# EAGLE design rfm69gw (EAGLE 7.3.0)
PROJECT_AUTHOR: tinkerman.cat <xose.perez@gmail.com>; PROJECT_LICENSE: GPLv3; PROJECT_NAME: RFM69GW; PROJECT_VERSION: 0.3.20160731
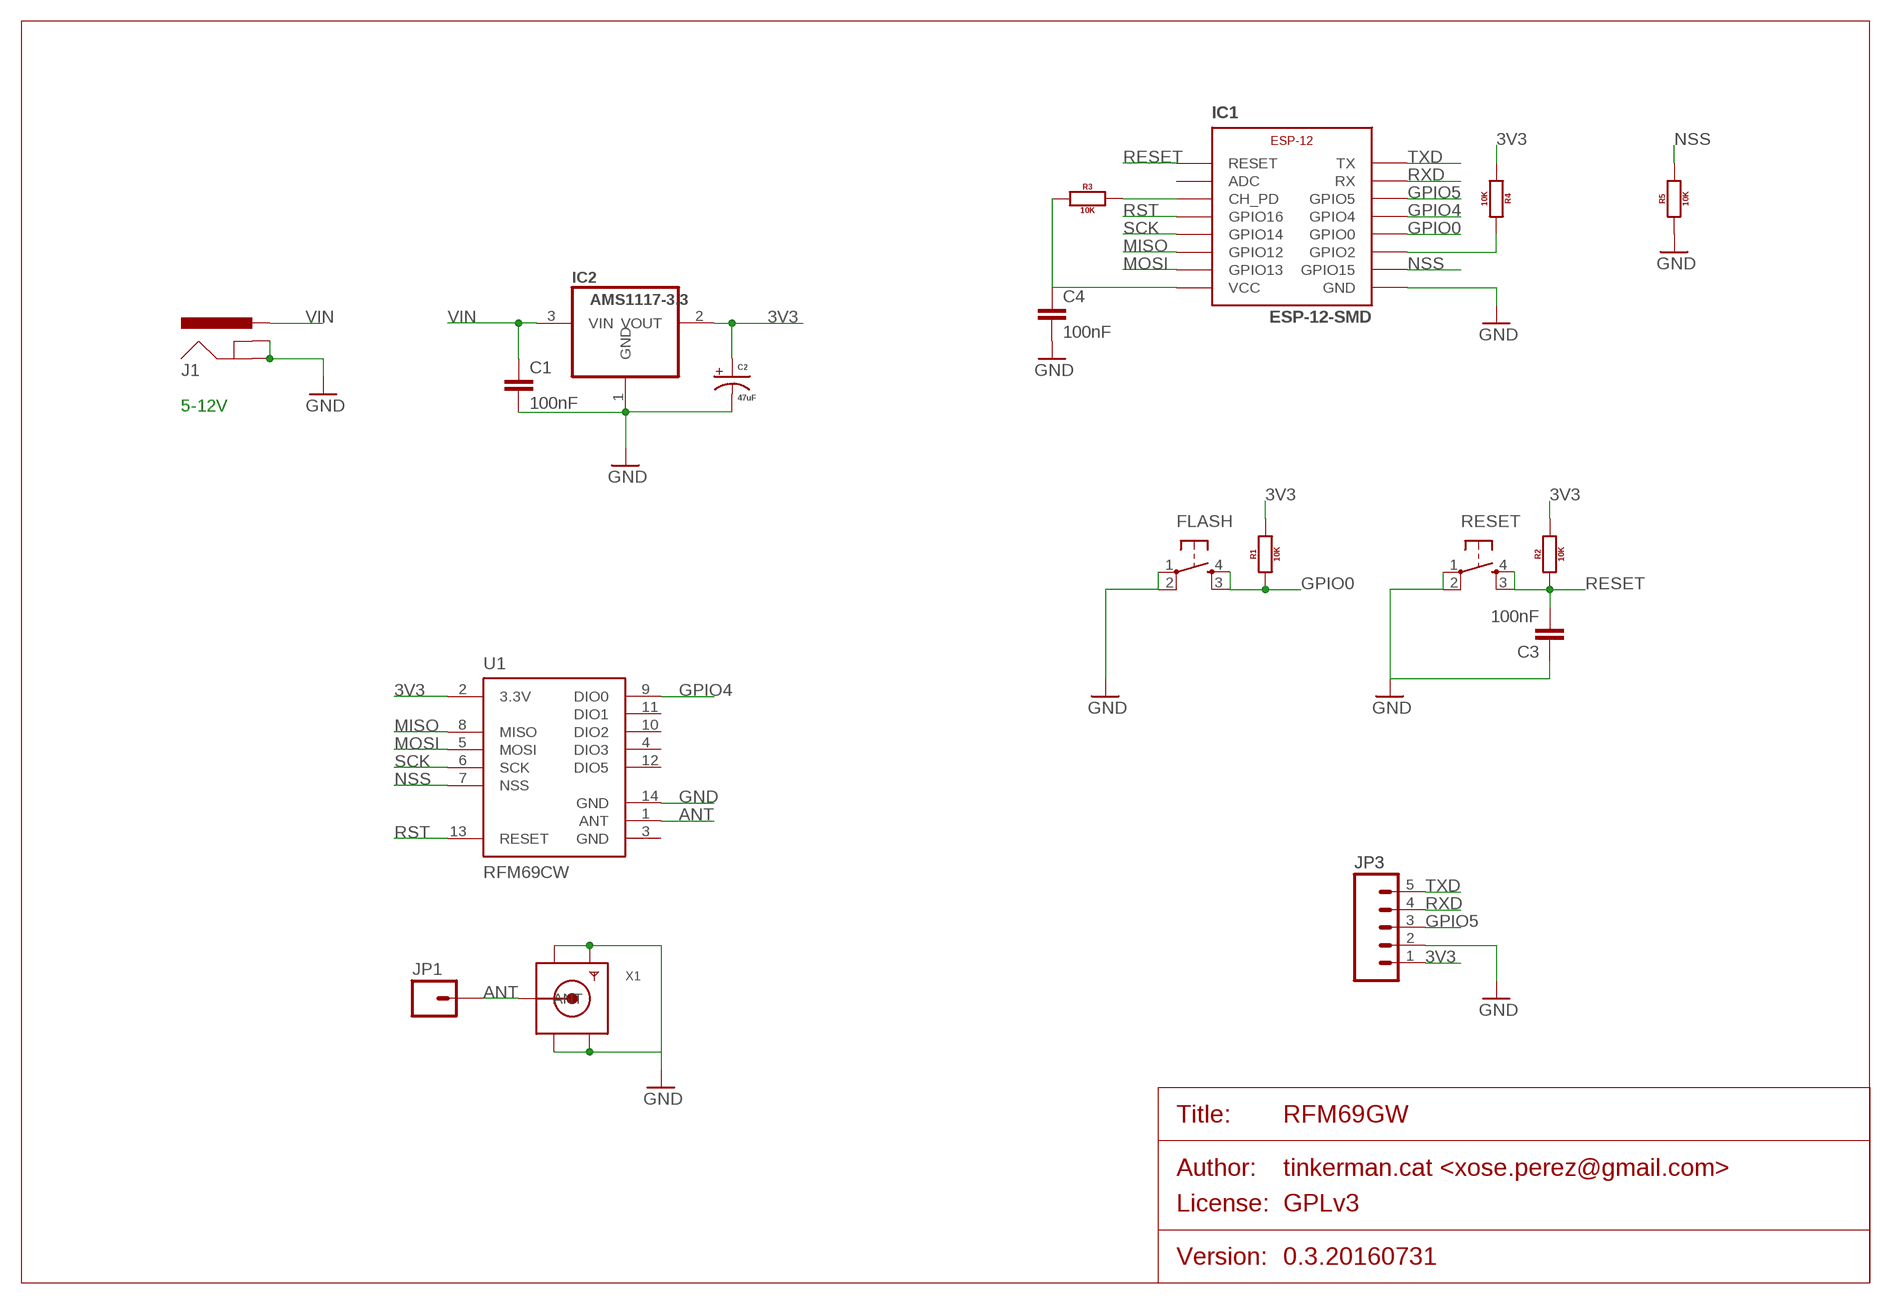
[diagram p0: schematic, sheet 1]

## Parts
C1  100nF  C-EU050-025X075  [C050-025X075]
C2  47uF  CAP_POLPTH2  [CPOL-RADIAL-10UF-25V]
C3  100nF  C-EU050-025X075  [C050-025X075]
C4  100nF  C-EU050-025X075  [C050-025X075]
FLASH  TACTILE_BUTTON_SMD  [TACTILE-BUTTON-SMD]
IC1  ESP-12-SMD  [ESP-12-SMD]
IC2  AMS1117-3.3  REG1117  [SOT223]
J1  POWER_JACKPTH  [POWER_JACK_PTH]
JP1  M01SMDNS  [1X01NS]
JP3  M05PTH  [1X05]
R1  10K  RESISTORPTH-400MIL  [AXIAL-0.4]
R2  10K  RESISTORPTH-400MIL  [AXIAL-0.4]
R3  10K  RESISTORPTH-400MIL  [AXIAL-0.4]
R4  10K  RESISTORPTH-400MIL  [AXIAL-0.4]
R5  10K  RESISTORPTH-400MIL  [AXIAL-0.4]
RESET  TACTILE_BUTTON_SMD  [TACTILE-BUTTON-SMD]
U1  RFM69CW  [RFM69CW-XXXS2]
X1  SMACONNECTOR_EDGE  [SMA_EDGELAUNCH]

## Nets
3V3: C2.1(+) C4.1 IC1.VCC IC2.2(VOUT) JP3.1 R1.P$2 R2.P$2 R3.P$1 R4.P$1 U1.2(3.3V)
ANT: JP1.1 U1.1(ANT) X1.P(ANT)
GND: C1.2 C2.2(-) C3.1 C4.2 FLASH.1(SWA1) FLASH.2(SWB1) IC1.GND IC2.1(GND) J1.GND J1.GNDBREAK JP3.2 R5.P$1 RESET.1(SWA1) RESET.2(SWB1) U1.14(GND) X1.GND@1(GND4) X1.GND@2(GND3) X1.GND@3(GND2) X1.GND@4(GND1)
GPIO0: FLASH.3(SWB2) FLASH.4(SWA2) IC1.GPIO0 R1.P$1
GPIO4: IC1.GPIO4 U1.9(DIO0)
GPIO5: IC1.GPIO5 JP3.3
MISO: IC1.GPIO12 U1.8(MISO)
MOSI: IC1.GPIO13 U1.5(MOSI)
N$1: IC1.CH_PD R3.P$2
N$4: IC1.GPIO2 R4.P$2
NSS: IC1.GPIO15 R5.P$2 U1.7(NSS)
RESET: C3.2 IC1.RESET R2.P$1 RESET.3(SWB2) RESET.4(SWA2)
RST: IC1.GPIO16 U1.13(RESET)
RXD: IC1.RX JP3.4
SCK: IC1.GPIO14 U1.6(SCK)
TXD: IC1.TX JP3.5
VIN: C1.1 IC2.3(VIN) J1.PWR
Unconnected: IC1.ADC U1.4(DIO3) U1.10(DIO2) U1.11(DIO1) U1.12(DIO5)

## Notes on the sheet
- 5-12V

## Power pins joined to a net without a drawn wire
GND: U1.3(GND)

## Library data of the parts
C1 C3 C4 = xose:C-EU: CAPACITOR, European symbol
C2 = xose:CAP_POL: Capacitor Polarized These are standard SMD and PTH capacitors. Normally 10uF, 47uF, and 100uF in electrolytic and tantalum varieties. Always verify the external diameter of the through hole cap, it varies with capacity, voltage, and manufacturer. The EIA devices should be standard.
FLASH RESET = xose:TACTILE_BUTTON: Tactile Button SparkFun Electronics' Tactile Button COM-10302
IC1 = xose:ESP-12
IC2 = xose:REG1117: 800mA and 1A Low Dropout (LDO) Positive Regulator 1.8V, 2.5V, 2.85V, 3.3V, 5V, and Adj; MPN: REG1117; OC_FARNELL: 1097566; OC_NEWARK: 14P6981
J1 = xose:POWER_JACK: Power Jack This is the standard 5.5mm barrel jack for power. The PTH is the most common, proven, reliable, footprint. The Slot footprint only works if the mill layer is transmitted to the PCB fab house so be warned. Mating wall wart : TOL-00298 (and others); PROD_ID: CONN-08197
JP1 = SparkFun-Connectors:M01: Header 1 Standard 1-pin 0.1" header. Use with straight break away headers (SKU : PRT-00116), right angle break away headers (PRT-00553), swiss pins (PRT-00743), machine pins (PRT-00117), and female headers (PRT-00115).
JP3 = xose:M05: Header 5 Standard 5-pin 0.1" header. Use with straight break away headers (SKU : PRT-00116), right angle break away headers (PRT-00553), swiss pins (PRT-00743), machine pins (PRT-00117), and female headers (PRT-00115). Molex polarized connector foot print use with SKU : PRT-08230 with associated crimp pins and housings.
R1-R5 = xose:RESISTOR: Generic EU resistor symbol
U1 = xose:RFM69
X1 = adafruit:SMACONNECTOR: SMA Connector 90° DIP SMA Connector, 50 Ohm (4UConnector: 07259)

## Board
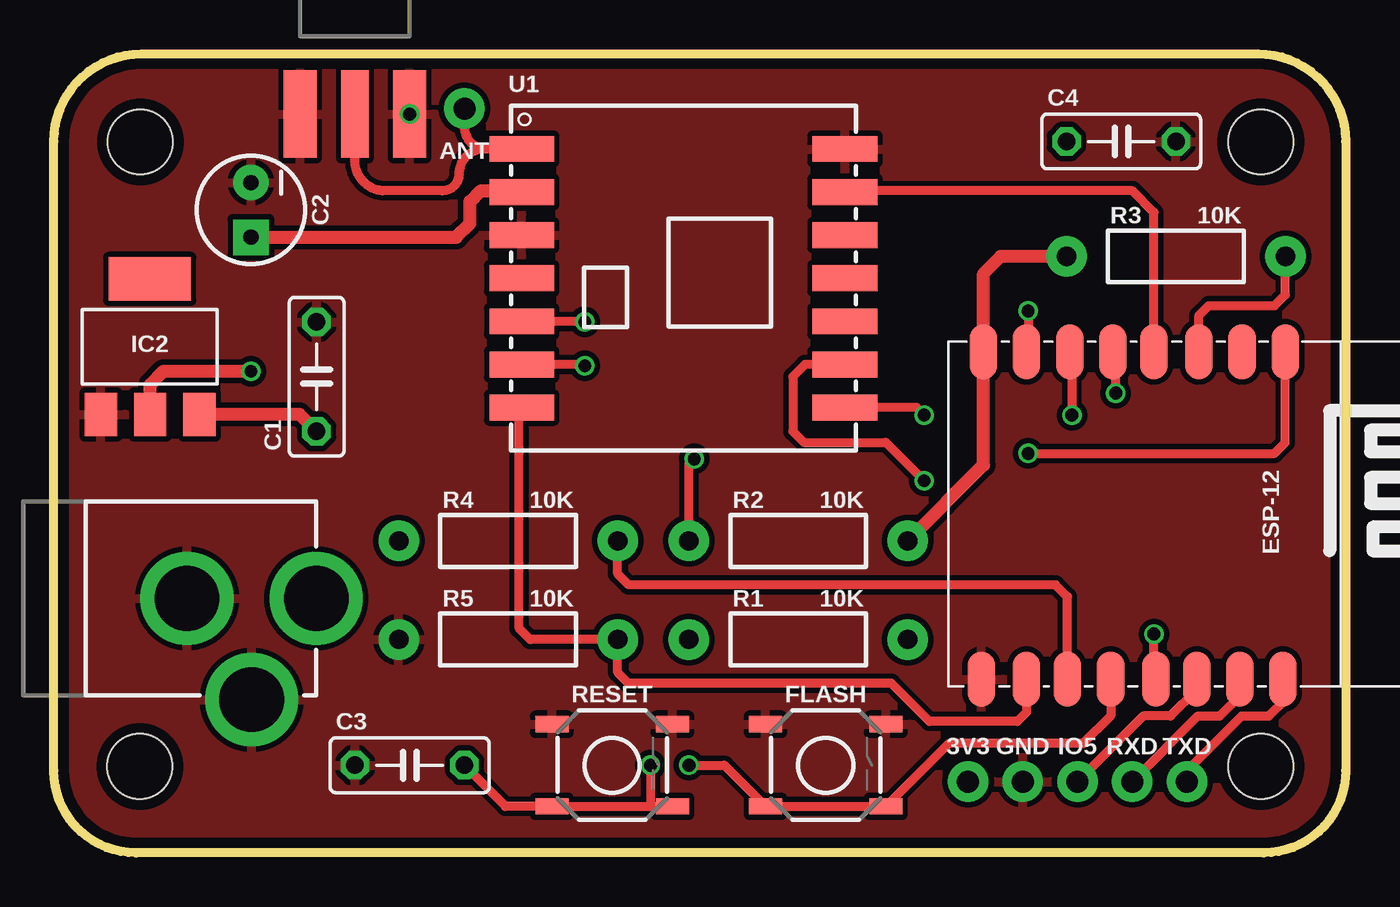
[diagram p1: board, top side]
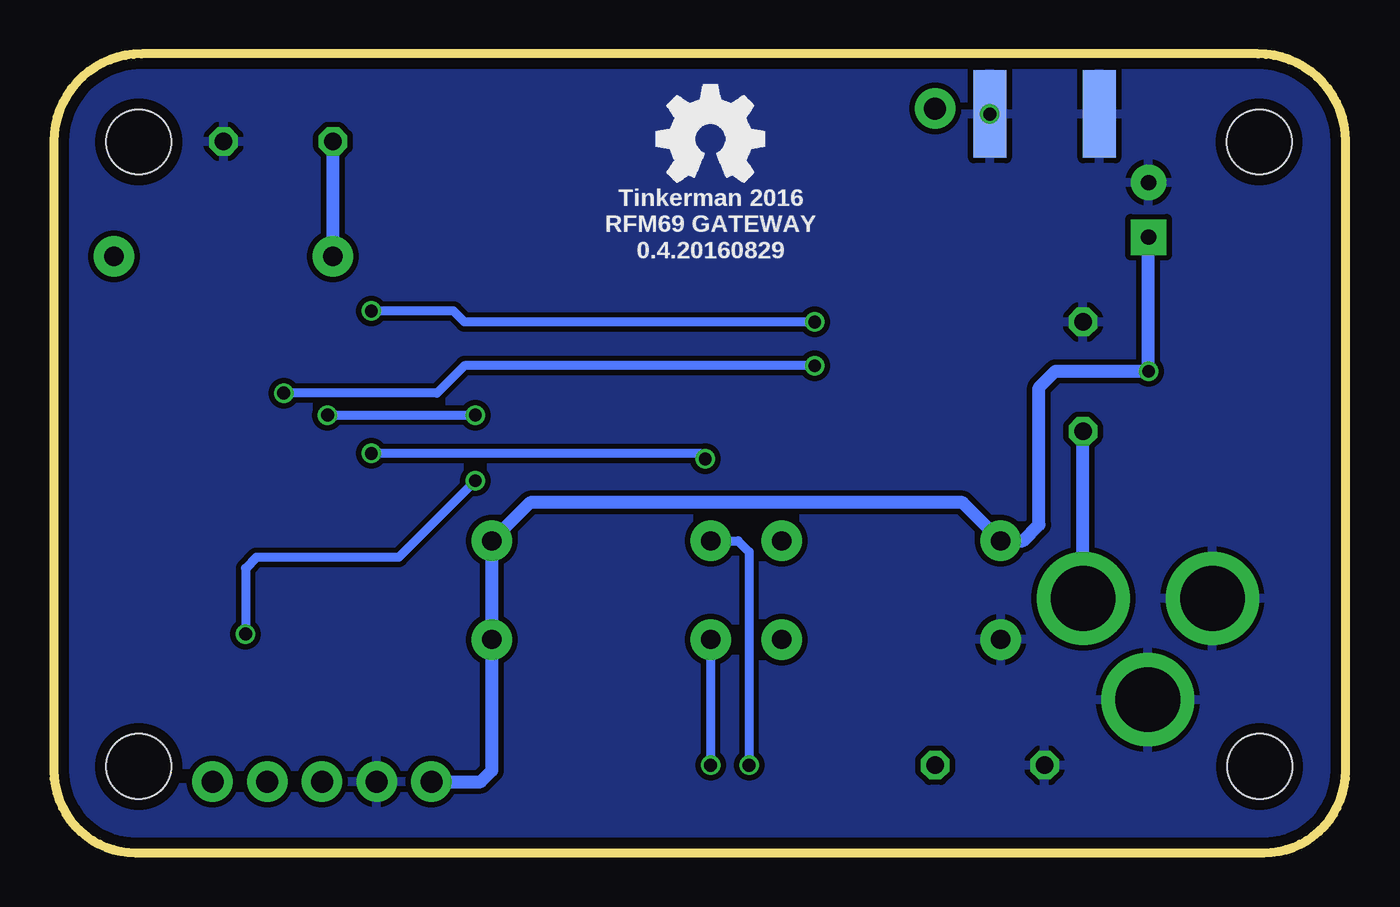
[diagram p2: board, bottom side, seen from below]

Size 59.94 x 37.08 mm. Coordinates in mm from the lower left corner, seen from the top.
Outline: 0,3.81 0,33.02 arc-90 4.06,37.08 55.88,37.08 arc-90 59.94,33.02 59.94,3.81 arc-90 56.13,0 3.81,0 arc-90 0,3.81
Copper layers (1*16): Top 0.035mm / dielectric 1.5mm / Bottom 0.035mm
Design rules "smart-prototyping": minimum track width 7mil, minimum drill 12mil, track to track 7mil, track to pad 7mil, pad to pad 7mil, via to via 7mil, smd to smd 0mil, copper to edge 20mil, drill to drill 10mil, minimum pad ring 10mil, minimum via ring 6mil, stop-mask expansion 2mil, vias tented up to drill 25mil, thermal gap 10mil
Holes 3 mm at 3.99,4.01 56.01,4.01 56.01,32.99 4.01,32.99

### Footprints (pad centres in the part's own frame; a part is rotated, then mirrored left to right if it is on the bottom)
C050-025X075 = drill 0.813 octagon: 1 -2.54,0; 2 2.54,0
CPOL-RADIAL-10UF-25V = drill 0.7 pad 1.651 square: 1 1.27,0 | drill 0.7 pad 1.651: 2 -1.27,0
TACTILE-BUTTON-SMD = smd 1.524 x 0.762: 1 -2.794,1.905; 2 2.794,1.905; 3 -2.794,-1.905; 4 2.794,-1.905
ESP-12-SMD = smd 2.54 x 1.27: ADC -7,5.1; CH_PD -7,3.1; GND 8.2,-7; GPIO0 8.2,-1; GPIO2 8.2,-3; GPIO4 8.2,1.1; GPIO5 8.2,3; GPIO12 -7,-2.9; GPIO13 -7,-4.9; GPIO14 -7,-0.9; GPIO15 8.2,-4.9; GPIO16 -7,1; RESET -7,7.1; RX 8.2,5; TX 8.2,7; VCC -7,-6.9
SOT223 = smd 1.499 x 2.007: 1 -2.261,-3.15; 2 0.025,-3.15; 3 2.311,-3.15 | smd 3.81 x 2.007: 4 0,3.15
POWER_JACK_PTH = drill 2.997 pad 4.318: GND 0,7.7; GNDBREAK 4.7,10.7; PWR 0,13.7
1X01NS = drill 1.016 pad 1.88: 1 0,0
1X05 = drill 1.016 pad 1.88: 1 0,0; 2 2.54,0; 3 5.08,0; 4 7.62,0; 5 10.16,0
AXIAL-0.4 = drill 0.9 pad 1.88: P$1 -5.08,0; P$2 5.08,0
RFM69CW-XXXS2 = smd 3 x 1.2: 1 -7.5,6; 2 -7.5,4; 3 -7.5,2; 4 -7.5,0; 5 -7.5,-2; 6 -7.5,-4; 7 -7.5,-6; 8 7.5,-6; 9 7.5,-4; 10 7.5,-2; 11 7.5,0; 12 7.5,2; 13 7.5,4; 14 7.5,6
SMA_EDGELAUNCH = smd 4.064 x 1.524: GND@1 2.032,-2.54; GND@2 2.032,2.54 | smd 4.064 x 1.524 bottom: GND@3 2.032,2.54; GND@4 2.032,-2.54 | smd 4.064 x 1.27: P 2.032,0

### Placement (x,y rotation side)
C1  12.19,22.1 90 top
C2  9.14,29.84 270 top
C3  16.51,4.06 0 top
C4  49.53,33.02 0 top
FLASH  35.81,4.06 0 top
IC1  50.04,16.26 270 top
IC2  4.45,23.5 0 top
J1  -1.52,11.81 270 top
JP1  19.05,34.54 0 top
JP3  42.42,3.3 0 top
R1  34.54,9.91 0 top
R2  34.54,14.48 0 top
R3  52.07,27.69 0 top
R4  21.08,14.48 0 top
R5  21.08,9.91 0 top
RESET  25.91,4.06 0 top
U1  29.21,26.67 0 top
X1  13.97,36.32 270 top

### Tracks (layer width: path | path; a pad name or v marks a point on that pad's centre or on a via)
3V3  (via drill 0.6)
  Top 0.61: R2.P$2 43.14,17.99 IC1.VCC 43.14,26.88 43.94,27.69 R3.P$1 | IC2.2 4.47,21.74 5.08,22.35 v9.14,22.35 | C2.1 18.67,28.57 19.3,29.21 19.3,30.23 19.81,30.73 21.65,30.73 U1.2
  Bottom 0.61: C2.1 v9.14,22.35 13.46,22.35 14.22,21.59 14.22,15.24 14.99,14.48 R4.P$1 17.78,16.26 37.85,16.26 R2.P$2 R1.P$2 39.62,3.81 40.13,3.3 JP3.1 | R3.P$1 C4.1
ANT
  Top 0.406: U1.1 20.07,32.67 | 20.07,32.67 19.97,32.67 arc90 18.8,31.5 arc-90 18.03,30.73 15.24,30.73 arc-90 13.97,32.26 X1.P | JP1.1 19.05,33.69 arc90 20.07,32.67
GND  (via drill 0.6)
  other vias: 16.51,34.29
  pour Top (isolate 0.254): 0,0 0,37.08 59.94,37.08 59.94,0
  pour Bottom (isolate 0.254): 0,37.08 59.94,37.08 59.94,33.02 59.94,0 0,0 0,4.57
GPIO0  (via drill 0.6)
  Top 0.406: v29.46,4.06 31.11,4.06 FLASH.3 FLASH.4 41.53,5.08 47.75,5.08 49.04,6.37 IC1.GPIO0
  Bottom 0.406: R1.P$1 v29.46,4.06
GPIO4  (via drill 0.6)
  Top 0.406: U1.9 34.86,22.67 34.29,22.1 34.29,19.56 34.8,19.05 38.61,19.05 v40.39,17.27 | IC1.GPIO4 51.05,8.06 v51.05,10.16
  Bottom 0.406: v40.39,17.27 43.94,13.72 50.55,13.72 51.05,13.21 v51.05,10.16
GPIO5
  Top 0.406: IC1.GPIO5 53.04,7.57 51.82,6.35 50.55,6.35 JP3.3
MISO  (via drill 0.6)
  Top 0.406: IC1.GPIO12 47.24,23.15 v47.24,20.32 | v40.39,20.32 40.04,20.67 U1.8
  Bottom 0.406: v47.24,20.32 v40.39,20.32
MOSI  (via drill 0.6)
  Top 0.406: v45.21,25.15 45.21,23.33 IC1.GPIO13 | 21.3,24.67 U1.5 24.61,24.67 v24.64,24.64
  Bottom 0.406: v24.64,24.64 40.89,24.64 41.4,25.15 v45.21,25.15
N$1
  Top 0.406: IC1.CH_PD 53.14,24.94 53.59,25.4 56.64,25.4 57.15,25.91 R3.P$2
N$4
  Top 0.406: IC1.GPIO2 47.04,11.89 46.48,12.45 26.67,12.45 26.16,12.95 R4.P$2
NSS
  Top 0.406: IC1.GPIO15 45.14,6.53 44.7,6.1 40.64,6.1 38.86,7.87 26.67,7.87 26.16,8.38 R5.P$2 22.1,9.91 21.59,10.41 21.59,20.55 arc-90 U1.7 21.49,20.67
RESET  (via drill 0.6)
  Top 0.406: 27.69,2.16 RESET.3 20.95,2.16 C3.2 | 27.69,2.16 RESET.4 | v27.69,4.06 27.69,2.16 | R2.P$1 29.46,18.03 v29.72,18.29 | v45.21,18.54 56.64,18.54 57.14,19.04 IC1.RESET
  Bottom 0.406: R2.P$1 28.19,14.48 27.69,13.97 v27.69,4.06 | v29.72,18.29 29.97,18.54 v45.21,18.54
RST
  Top 0.406: IC1.GPIO16 51.05,23.26 51.05,29.72 50.04,30.73 36.77,30.73 U1.13
RXD
  Top 0.406: JP3.4 53.09,6.35 54.1,6.35 55.12,7.37 55.12,7.98 IC1.RX
SCK  (via drill 0.6)
  Top 0.406: v49.28,21.34 49.28,23.12 IC1.GPIO14 | 21.27,22.67 U1.6 24.57,22.67 v24.64,22.61
  Bottom 0.406: v24.64,22.61 40.89,22.61 42.16,21.34 v49.28,21.34
TXD
  Top 0.406: 56.9,7.62 56.9,7.91 IC1.TX 57.15,7.94 57.15,7.11 56.39,6.35 55.12,6.35 52.58,3.81 JP3.5
VIN
  Top 0.61: C1.1 11.41,20.34 IC2.3
  Bottom 0.61: J1.PWR 12.19,13.35 C1.1

### Text on the board
tPlace: ANT | 3V3 | GND | IO5 | RXD | TXD
bPlace: Tinkerman 2016 / RFM69 GATEWAY / 0.4.20160829